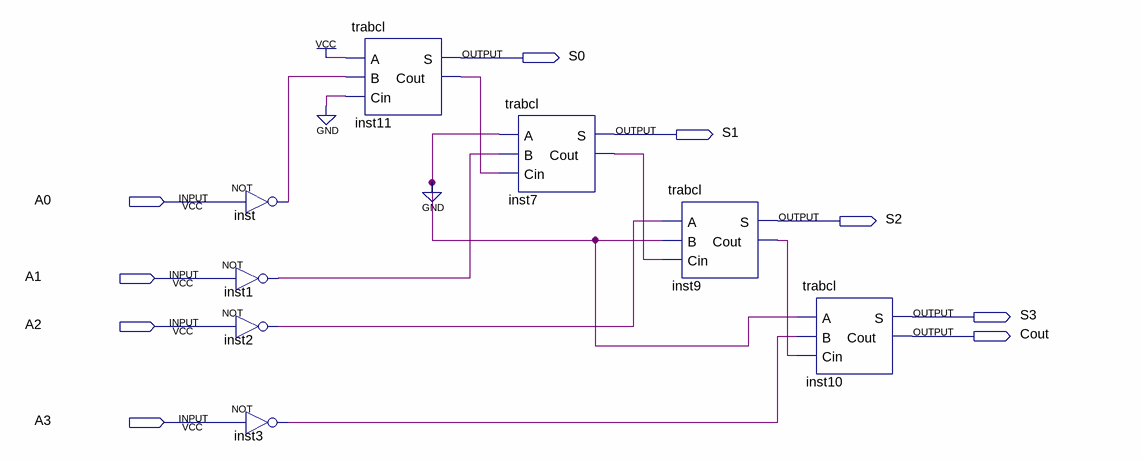
[diagram p0: schematic sheet]
// Quartus schematic conversorcomplemento2.bdf as structural Verilog: 8 symbols, 9 pins
module conversorcomplemento2 (
  input  A0,
  input  A1,
  input  A2,
  input  A3,
  output S0,
  output S1,
  output S2,
  output S3,
  output Cout
);

  wire inst1_out, inst2_out, inst3_out, inst7_cout, inst9_cout, inst11_cout, inst_out;

  not inst1 (inst1_out, A1);
  not inst2 (inst2_out, A2);
  not inst (inst_out, A0);
  not inst3 (inst3_out, A3);
  trabcl inst11 (.A(1'b1), .B(inst_out), .Cin(1'b0), .S(S0), .Cout(inst11_cout));
  trabcl inst7 (.A(1'b0), .B(inst1_out), .Cin(inst11_cout), .S(S1), .Cout(inst7_cout));
  trabcl inst9 (.A(inst2_out), .B(1'b0), .Cin(inst7_cout), .S(S2), .Cout(inst9_cout));
  trabcl inst10 (.A(1'b0), .B(inst3_out), .Cin(inst9_cout), .S(S3), .Cout(Cout));
endmodule
